# Altium schematic sheet RdriveC1.SchDoc
size A2; SheetNumber: 1
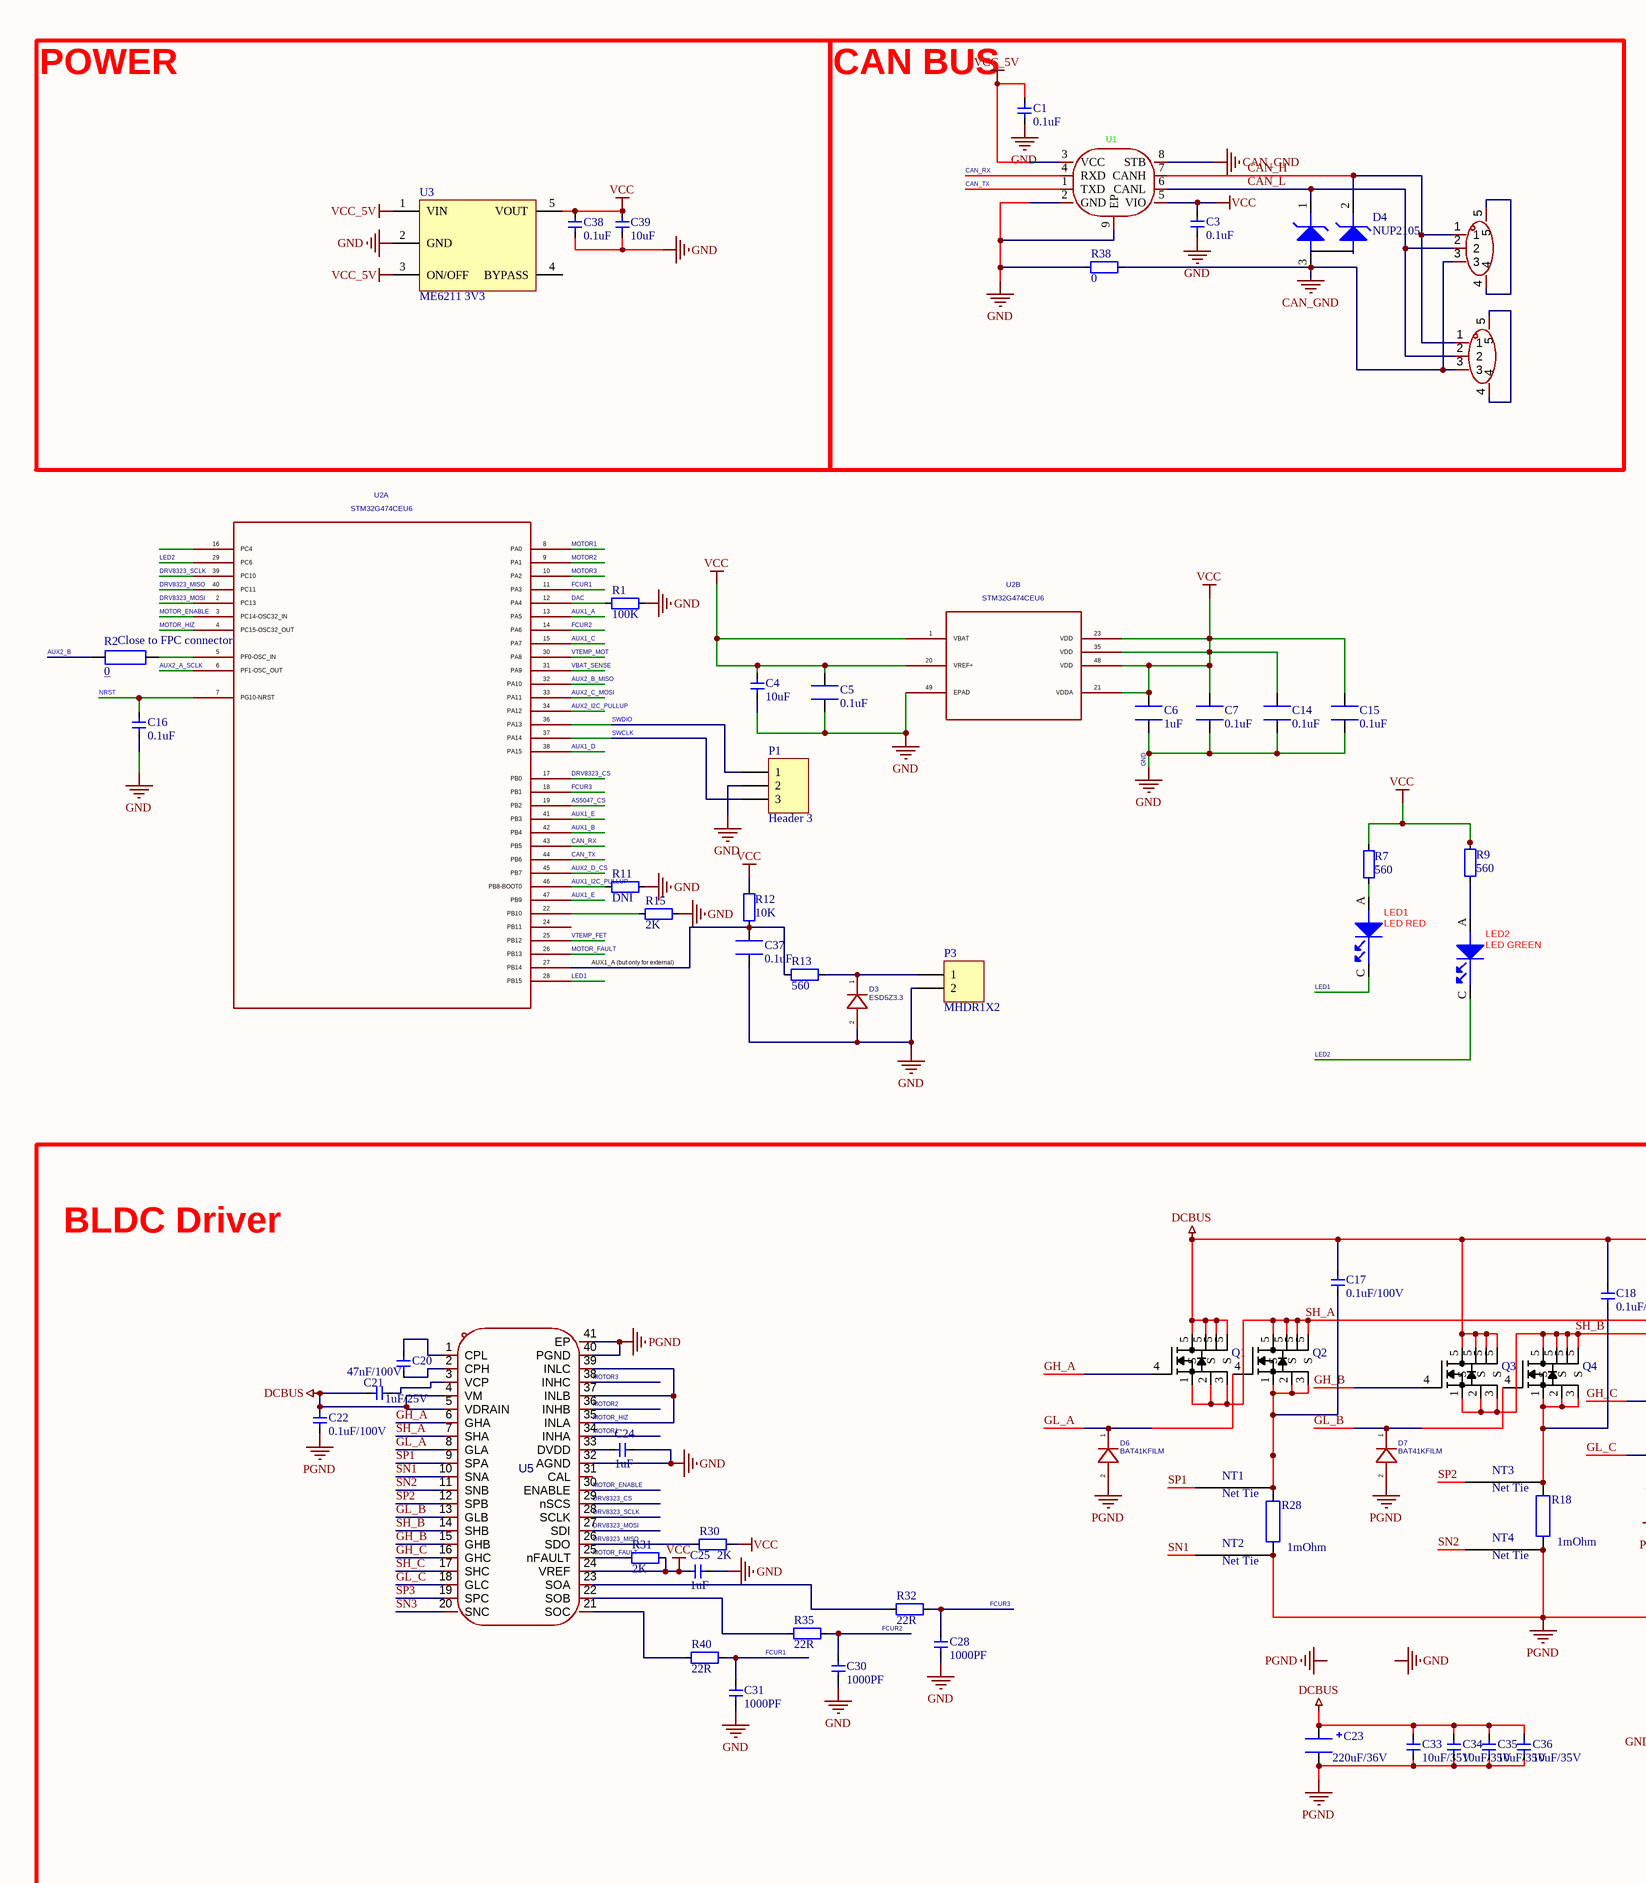
[diagram p0: RdriveC1.SchDoc, left]
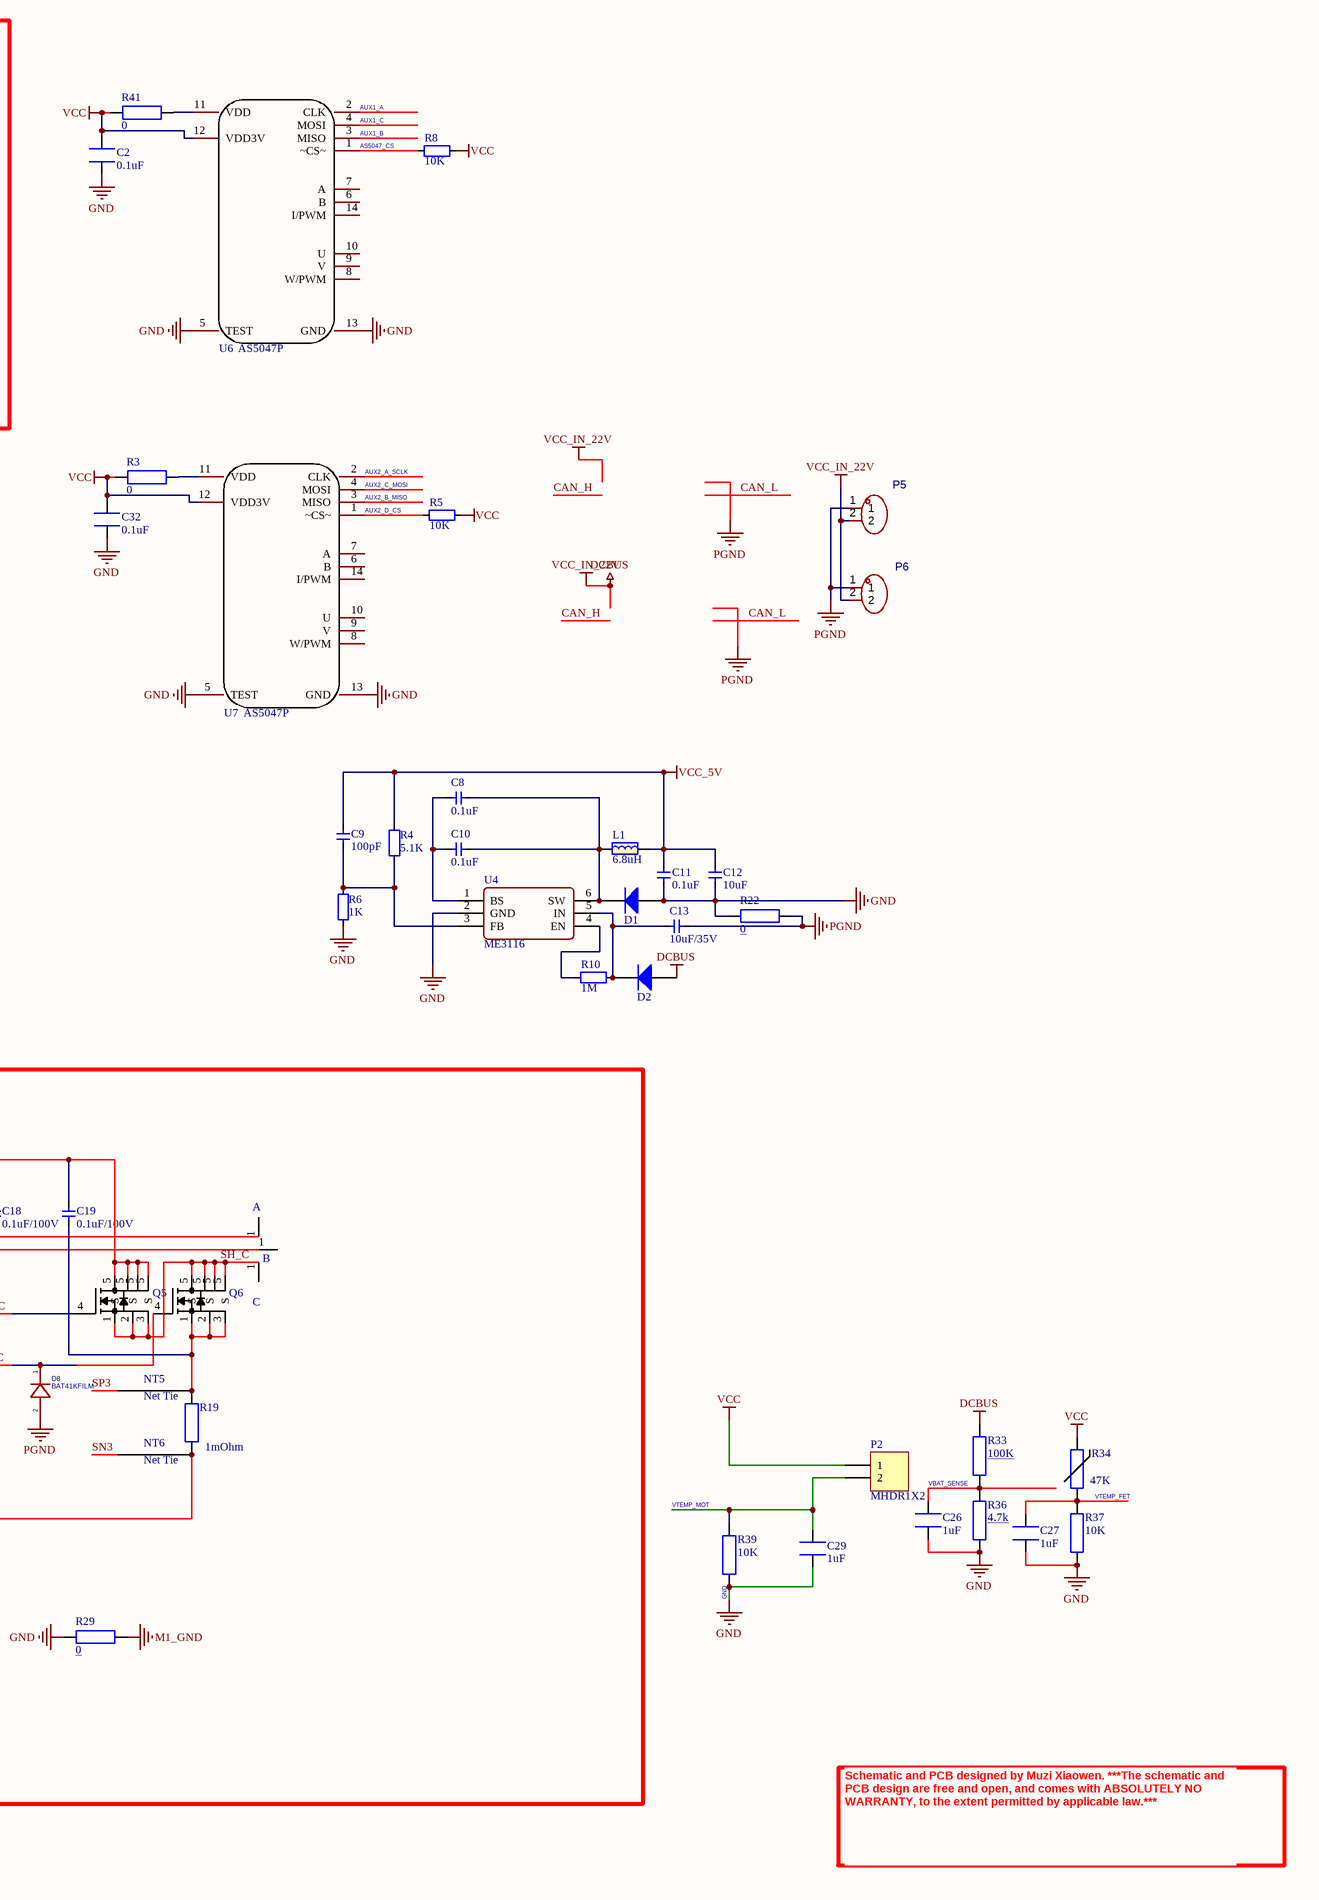
[diagram p1: RdriveC1.SchDoc, right]

## Parts
A  M  [motor]  (value not drawn)
B  M  [motor]  (value not drawn)
C  M  [motor]  (value not drawn)
C1  0.1uF  [CAP_0402]
C2  0.1uF  [CAP_0402]
C3  0.1uF  [CAP_0402]
C4  10uF  [CAP_0402]
C5  0.1uF  [CAP_0402]
C6  1uF  [CAP_0402]
C7  0.1uF  [CAP_0402]
C8  0.1uF  [CAP_0402]
C9  100pF  [CAP_0402]
C10  0.1uF  [CAP_0402]
C11  0.1uF  [CAP_0402]
C12  10uF  [CAP_0402]
C13  10uF/35V  [C0603]
C14  0.1uF  [CAP_0402]
C15  0.1uF  [CAP_0402]
C16  0.1uF  [CAP_0402]
C17  0.1uF/100V  [1206-RES]
C18  0.1uF/100V  [1206-RES]
C19  0.1uF/100V  [1206-RES]
C20  47nF/100V  [C0603]
C21  1uF/25V  [C0603]
C22  0.1uF/100V  [C0603]
C23  value 220uF/36V  [3d-CAP-SMD_BD6.3-L6.6-W6.6-LS7.2-FD]  (hidden comment: 220uF)
C24  1uF  [CAP_0402]
C25  1uF  [CAP_0402]
C26  1uF  [CAP_0402]
C27  1uF  [CAP_0402]
C28  1000PF  [CAP_0402]
C29  1uF  [CAP_0402]
C30  1000PF  [CAP_0402]
C31  1000PF  [CAP_0402]
C32  0.1uF  [CAP_0402]
C33  10uF/35V  [C0603-3d]
C34  10uF/35V  [C0603-3d]
C35  10uF/35V  [C0603-3d]
C36  10uF/35V  [C0603-3d]
C37  0.1uF  [CAP_0402]
C38  0.1uF  [CAP_0402]
C39  10uF  [CAP_0402]
CN1  WAFER-GH1.25-3PLT-W1-P  [CONN-SMD_WAFER-GH1.25-3PLT-W1-P]  (value not drawn)
CN2  WAFER-GH1.25-3PLT-W1-P  [CONN-SMD_WAFER-GH1.25-3PLT-W1-P]  (value not drawn)
D1  二极管-5819W  [SOD-323]  (value not drawn)
D2  二极管-5819W  [SOD-323]  (value not drawn)
D3  value ESD5Z3.3  [moteus:SOD-523_STM]  (hidden comment: moteus_BAT41KFILM)
D4  NUP2105  [SOT23-3]
D6  value BAT41KFILM  [moteus:SOD-523_STM]  (hidden comment: moteus_BAT41KFILM)
D7  value BAT41KFILM  [moteus:SOD-523_STM]  (hidden comment: moteus_BAT41KFILM)
D8  value BAT41KFILM  [moteus:SOD-523_STM]  (hidden comment: moteus_BAT41KFILM)
L1  6.8uH  [IND-201612]
LED1  LED RED  [LC-0603_LED_S3]
LED2  LED GREEN  [LC-0603_LED_S3]
NT1  0.25mm  [NetTie_0.25mm]  (value not drawn)  (net tie, no BOM)
NT2  0.25mm  [NetTie_0.25mm]  (value not drawn)  (net tie, no BOM)
NT3  0.25mm  [NetTie_0.25mm]  (value not drawn)  (net tie, no BOM)
NT4  0.25mm  [NetTie_0.25mm]  (value not drawn)  (net tie, no BOM)
NT5  0.25mm  [NetTie_0.25mm]  (value not drawn)  (net tie, no BOM)
NT6  0.25mm  [NetTie_0.25mm]  (value not drawn)  (net tie, no BOM)
P1  Header 3  [HDR1X3]
P2  MHDR1X2  [MHDR1X2]
P3  MHDR1X2  [CONN-TH_2P-P1.50_HCTL_HC-ZH1.5-2AW]
P5  HC-MX3.0-2*1AW  [CONN-TH_XT30UW-F.G.Y]  (value not drawn)
P6  HC-MX3.0-2*1AW  [CONN-TH_XT30UW-F.G.Y]  (value not drawn)
Q1  SE3082G2  [DFN-8_L5.9-W5.2-P1.27-LS6.2-BL]  (value not drawn)
Q2  SE3082G2  [DFN-8_L5.9-W5.2-P1.27-LS6.2-BL]  (value not drawn)
Q3  SE3082G2  [DFN-8_L5.9-W5.2-P1.27-LS6.2-BL]  (value not drawn)
Q4  SE3082G2  [DFN-8_L5.9-W5.2-P1.27-LS6.2-BL]  (value not drawn)
Q5  SE3082G2  [DFN-8_L5.9-W5.2-P1.27-LS6.2-BL]  (value not drawn)
Q6  SE3082G2  [DFN-8_L5.9-W5.2-P1.27-LS6.2-BL]  (value not drawn)
R1  100K  [RES_0402]
R2  0  [RES_0402]
R3  0  [RES_0402]
R4  5.1K  [RES_0402]
R5  10K  [RES_0402]
R6  1K  [RES_0402]
R7  560  [RES_0402]
R8  10K  [RES_0402]
R9  560  [RES_0402]
R10  1M  [RES_0402]
R11  DNI  [RES_0402]
R12  10K  [RES_0402]
R13  560  [RES_0402]
R15  2K  [RES_0402]
R18  1mOhm  [1206-RES]
R19  1mOhm  [1206-RES]
R22  0  [1206-RES]
R28  1mOhm  [1206-RES]
R29  0  [RES_0402]
R30  2K  [RES_0402]
R31  2K  [RES_0402]
R32  22R  [RES_0402]
R33  100K  [RES_0402]
R34  47K  [CAP_0402]
R35  22R  [RES_0402]
R36  4.7k  [RES_0402]
R37  10K  [RES_0402]
R38  0  [RES_0402]
R39  10K  [RES_0402]
R40  22R  [RES_0402]
R41  0  [RES_0402]
U1  TCAN1057AVDRBRQ1  [SOIC8_2]  (value not drawn)
U2  value STM32G474CEU6  [moteus:UFQFPN-48_7X7X0P55MM]  (hidden comment: moteus_STM32G474CEU6)  (parts A,B of 2)
U3  ME6211 3V3  [SOT23-5-3d]
U4  ME3116  [SOT23-6]
U5  DRV8323SRTAR  [WQFN-40_L6.0-W6.0-P0.50-TL-EP4.5]  (value not drawn)
U6  AS5047P  [TSSOP14_2]
U7  AS5047P  [TSSOP14_2]

## Blocks framed on the sheet
POWER: C38 C39 U3
CAN BUS: C1 C3 CN1 CN2 D4 R38 U1
BLDC Driver: A B C C17-C25 C28 C30 C31 C33-C36 D6-D8 NT1-NT6 Q1-Q6 R18 R19 R28-R32 R35 R40 U5

## Nets
CAN_GND: CN1.3 CN2.3 D4.3(A) R38.2 U1.8(STB)
DCBUS: C17.1 C18.1 C19.1 C21.2 C22.1 C23.1 C33.2 C34.2 C35.2 C36.2 D2.1(A) P5.2 P6.2 Q1.5(D) Q3.5(D) Q5.5(D) R33.2 U5.4(VM) U5.5(VDRAIN)  [also labelled VCC_IN_22V]
GND: C1.2 C2.2 C3.2 C4.1 C5.2 C6.2 C7.1 C11.1 C12.1 C14.2 C15.2 C16.1 C24.1 C25.1 C26.2 C27.2 C28.1 C29.2 C30.1 C31.1 C32.2 C37.2 C38.1 C39.1 D1.1(A) D3.2 P1.2 P3.2 R1.2 R6.2 R11.2 R15.2 R22.2 R29.1 R36.1 R37.2 R38.1 R39.2 U1.2(GND) U1.9(EP) U2.49(EPAD) U3.2(GND) U4.2(GND) U5.32(AGND) U6.5(TEST) U6.13(GND) U7.5(TEST) U7.13(GND)
M1_GND: R29.2
PGND: C13.2 C22.2 C23.2 C33.1 C34.1 C35.1 C36.1 D6.2 D7.2 D8.2 NT2.2 NT4.2 NT6.2 P5.1 P6.1 R18.1 R19.1 R22.1 R28.1 U5.40(PGND) U5.41(EP)
VCC: C2.1 C3.1 C4.2 C5.1 C6.1 C7.2 C14.1 C15.1 C25.2 C32.1 C38.2 C39.2 P2.1 R3.1 R5.1 R7.1 R8.1 R9.1 R12.1 R30.2 R31.2 R34.2 R41.1 U1.5(VIO) U2.1(VBAT) U2.20(VREF+) U2.21(VDDA) U2.23(VDD) U2.35(VDD) U2.48(VDD) U3.5(VOUT) U5.24(VREF) U6.12(VDD3V) U7.12(VDD3V)
VCC_5V: C1.1 C9.1 C11.2 C12.2 L1.2 R4.1 U1.3(VCC) U3.1(VIN) U3.3(ON/OFF)
AS5047_CS: R8.2 U2.19(PB2) U6.1(~CS~)
AUX1_A: U2.13(PA5) U6.2(CLK)
AUX1_B: U2.42(PB4) U6.3(MISO)
AUX1_C: U2.15(PA7) U6.4(MOSI)
AUX1_D: U2.38(PA15)
AUX1_E: U2.41(PB3) U2.47(PB9)
AUX1_I2C_PULLUP: R11.1 U2.46(PB8-BOOT0)
AUX2_A_SCLK: U2.6(PF1-OSC_OUT) U7.2(CLK)
AUX2_B: R2.1
AUX2_B_MISO: U2.32(PA10) U7.3(MISO)
AUX2_C_MOSI: U2.33(PA11) U7.4(MOSI)
AUX2_D_CS: R5.2 U2.45(PB7) U7.1(~CS~)
AUX2_I2C_PULLUP: U2.34(PA12)
CAN_H: CN1.1 CN2.1 D4.2(C) U1.7(CANH)
CAN_L: CN1.2 CN2.2 D4.1(C) U1.6(CANL)
CAN_RX: U1.4(RXD) U2.43(PB5)
CAN_TX: U1.1(TXD) U2.44(PB6)
DAC: R1.1 U2.12(PA4)
DRV8323_CS: U2.17(PB0) U5.29(nSCS)
DRV8323_MISO: R30.1 U2.40(PC11) U5.26(SDO)
DRV8323_MOSI: U2.2(PC13) U5.27(SDI)
DRV8323_SCLK: U2.39(PC10) U5.28(SCLK)
FCUR1: C31.2 R40.1 U2.11(PA3)
FCUR2: C30.2 R35.1 U2.14(PA6)
FCUR3: C28.2 R32.1 U2.18(PB1)
GH_A: Q1.4(G1) U5.6(GHA)
GH_B: Q3.4(G1) U5.15(GHB)
GH_C: Q5.4(G1) U5.16(GHC)
GL_A: D6.1 Q2.4(G1) U5.8(GLA)
GL_B: D7.1 Q4.4(G1) U5.13(GLB)
GL_C: D8.1 Q6.4(G1) U5.18(GLC)
LED1: LED1.C(CATHODE) U2.28(PB15)
LED2: LED2.C(CATHODE) U2.29(PC6)
MOTOR1: U2.8(PA0) U5.34(INHA)
MOTOR2: U2.9(PA1) U5.36(INHB)
MOTOR3: U2.10(PA2) U5.38(INHC)
MOTOR_ENABLE: U2.3(PC14-OSC32_IN) U5.30(ENABLE)
MOTOR_FAULT: R31.1 U2.26(PB13) U5.25(nFAULT)
MOTOR_HIZ: U2.4(PC15-OSC32_OUT) U5.35(INLA) U5.37(INLB) U5.39(INLC)
NRST: C16.2 U2.7(PG10-NRST)
SH_A: A.1 Q1.1(S) Q1.2(S) Q1.3(S) Q2.5(D) U5.7(SHA)
SH_B: B.1 Q3.1(S) Q3.2(S) Q3.3(S) Q4.5(D) U5.14(SHB)
SH_C: C.1 Q5.1(S) Q5.2(S) Q5.3(S) Q6.5(D) U5.17(SHC)
SN1: NT2.1 U5.10(SNA)
SN2: NT4.1 U5.11(SNB)
SN3: NT6.1 U5.20(SNC)
SP1: NT1.1 U5.9(SPA)
SP2: NT3.1 U5.12(SPB)
SP3: NT5.1 U5.19(SPC)
SWCLK: P1.3 U2.37(PA14)
SWDIO: P1.1 U2.36(PA13)
VBAT_SENSE: C26.1 R33.1 R36.2 U2.31(PA9)
VTEMP_FET: C27.1 R34.1 R37.1 U2.25(PB12)
VTEMP_MOT: C29.1 P2.2 R39.1 U2.30(PA8)
NetC8_1: C8.1 C10.1 D1.2(K) L1.1 U4.6(SW)
NetC8_2: C8.2 C10.2 U4.1(BS)
NetC9_2: C9.2 R4.2 R6.1 U4.3(FB)
NetC13_1: C13.1 D2.2(K) R10.2 U4.5(IN)
NetC17_2: C17.2 NT1.2 Q2.1(S) Q2.2(S) Q2.3(S) R28.2
NetC18_2: C18.2 NT3.2 Q4.1(S) Q4.2(S) Q4.3(S) R18.2
NetC19_2: C19.2 NT5.2 Q6.1(S) Q6.2(S) Q6.3(S) R19.2
NetC20_1: C20.1 U5.2(CPH)
NetC20_2: C20.2 U5.1(CPL)
NetC21_1: C21.1 U5.3(VCP)
NetC24_2: C24.2 U5.33(DVDD)
NetC37_1: C37.1 R12.2 R13.1 U2.27(PB14)
NetCN1_4: CN1.4 CN1.5
NetCN2_4: CN2.4 CN2.5
NetD3_1: D3.1 P3.1 R13.2
NetLED1_A: LED1.A(ANODE) R7.2
NetLED2_A: LED2.A(ANODE) R9.2
NetR2_2: R2.2 U2.5(PF0-OSC_IN)
NetR3_2: R3.2 U7.11(VDD)
NetR10_1: R10.1 U4.4(EN)
NetR15_1: R15.1 U2.22(PB10)
NetR32_2: R32.2 U5.23(SOA)
NetR35_2: R35.2 U5.22(SOB)
NetR40_2: R40.2 U5.21(SOC)
NetR41_2: R41.2 U6.11(VDD)

Not connected (* = marked no-connect by the designer): U2 16(PC4) 24(PB11); U3 4(BYPASS); U5 31(CAL); U6 6(B) 7(A) 8(W/PWM) 9(V) 10(U) 14(I/PWM); U7 6(B) 7(A) 8(W/PWM) 9(V) 10(U) 14(I/PWM)

## Notes on the sheet
- (near U2) Close to FPC connector
- AUX1_A (but only for external)
- Schematic and PCB designed by Muzi Xiaowen. ***The schematic and PCB design are free and open, and comes with ABSOLUTELY NO WARRANTY, to the extent permitted by applicable law.***
- Labels drawn without touching a wire or pin: GND, PGND
- (in symbol NetTie_0.25mm) Net Tie

## Library data of the parts
C1 C3 C4 C8 C10-C12 C16 C38 C39 = 电容-0402: Capacitor; Value: 0.1u
C2 C5 C7 C14 C15 C32 C37 = GRM188R71H104KA93D: CAP CER 0.1UF 50V X7R 0603; Manufacturer: Murata Electronics North America; Tolerance: ±10%; Supplier 1: Digi-Key; Supplier Part Number 1: 490-1519-2-ND; Manufacturer Part Number: GRM188R71H104KA93D; RoHS: RoHS Compliant; Category: Capacitors; Pricing 1: 4000=0.01822, 8000=0.01663, 12000=0.01584 (USD); Packaging: Tape & Reel (TR); Capacitance: 0.1uF; Voltage - Rated: 50V; Temperature Coefficient: X7R; Mounting Type: Surface Mount, MLCC; Operating Temperature: -55°C ~ 125°C; Applications: General Purpose; Ratings: -; Package / Case: 0603 (1608 Metric); Size / Dimension: 0.063" L x 0.032" W (1.60mm x 0.80mm); Height - Seated (Max): -; Thickness (Max): 0.035" (0.90mm); Lead Spacing: -; Features: -; Lead Style: -; ComponentLink1URL: http://www.murata.com/~/media/webrenewal/support/library/catalog/products/capacitor/mlcc/c02e.ashx?la=en-us; ComponentLink1Description: http://www.murata.com/~/media/webrenewal/support/library/catalog/products/capacitor/mlcc/c02e.ashx?la=en-us; Stock: 19812000; Part Status: Active; Supplier 2: Digi-Key; Supplier Part Number 2: 490-1519-1-ND; Pricing 2: 1=0.12, 10=0.084, 100=0.0396, 500=0.02778, 1000=0.023 (USD)
C6 C26 C27 C29 = GRM188R71H104KA93D: CAP CER 1UF 50V X7R 0603; Manufacturer: Murata Electronics North America; Tolerance: ±10%; Supplier 1: Digi-Key; Supplier Part Number 1: 490-1519-2-ND; Manufacturer Part Number: GRM188R71H104KA93D; RoHS: RoHS Compliant; Category: Capacitors; Pricing 1: 4000=0.01822, 8000=0.01663, 12000=0.01584 (USD); Packaging: Tape & Reel (TR); Capacitance: 1uF; Voltage - Rated: 50V; Temperature Coefficient: X7R; Mounting Type: Surface Mount, MLCC; Operating Temperature: -55°C ~ 125°C; Applications: General Purpose; Ratings: -; Package / Case: 0603 (1608 Metric); Size / Dimension: 0.063" L x 0.032" W (1.60mm x 0.80mm); Height - Seated (Max): -; Thickness (Max): 0.035" (0.90mm); Lead Spacing: -; Features: -; Lead Style: -; ComponentLink1URL: http://www.murata.com/~/media/webrenewal/support/library/catalog/products/capacitor/mlcc/c02e.ashx?la=en-us; ComponentLink1Description: http://www.murata.com/~/media/webrenewal/support/library/catalog/products/capacitor/mlcc/c02e.ashx?la=en-us; Stock: 19812000; Part Status: Active; Supplier 2: Digi-Key; Supplier Part Number 2: 490-1519-1-ND; Pricing 2: 1=0.12, 10=0.084, 100=0.0396, 500=0.02778, 1000=0.023 (USD)
C9 C17-C22 C24 C25 C28 C30 C31 = 电容-0402: Capacitor
  C9: Value: 100pF
  C17-C19 C22: Value: 0.1uF/100V
  C20: Value: 47nF/100V
  C21: Value: 1uF/25V
  C24 C25: Value: 1uF
  C28 C30 C31: Value: 1000PF
C13 C33-C36 = 电容-0402: Capacitor; Value: 22uF 35V
C23 = EEEFP1E471AP: CAP, FP Series, 470 µF, 25 V, Radial Can - SMD, 10 mm; Manufacturer: Panasonic Electronic Components; Manufacturer Part Number: EEE-FP1E471AP; Tolerance: ±20%; ESR (Equivalent Series Resistance): 60 mOhm @ 100kHz; Lifetime @ Temp.: 2000 Hrs @ 105°C; Polarization: Polar; Ripple Current - Low Frequency: 773.5mA @ 120Hz; Ripple Current - High Frequency: 1.19A @ 100kHz; Surface Mount Land Size: 0.406" L x 0.406" W (10.30mm x 10.30mm); Supplier 1: Digi-Key; Supplier Part Number 1: PCE4440TR-ND; RoHS: RoHS Compliant; Category: Capacitors; Stock: 8000; Pricing 1: 500=0.3571, 1000=0.30072, 2500=0.28192, 5000=0.26313, 12500=0.24997, 25000=0.24434 (USD); Packaging: Tape & Reel (TR); Part Status: Active; Operating Temperature: -55°C ~ 105°C; Applications: Automotive; Lead Spacing: -; Size / Dimension: 0.394" Dia (10.00mm); Height - Seated (Max): 0.402" (10.20mm); Mounting Type: Surface Mount; Package / Case: Radial, Can - SMD; ComponentLink1URL: http://industrial.panasonic.com/www-cgi/jvcr13pz.cgi?E+PZ+3+ABA0114+EEEFP1E471AP+7+WW; ComponentLink1Description: http://industrial.panasonic.com/www-cgi/jvcr13pz.cgi?E+PZ+3+ABA0114+EEEFP1E471AP+7+WW; Supplier 2: Digi-Key; Supplier Part Number 2: PCE4440CT-ND; Pricing 2: 1=0.92, 10=0.702, 100=0.5025 (USD)
D1 D2 = 二极管-5819W: 40V
D3 D6-D8 = moteus_BAT41KFILM: MF: ST; POPULATE: 1; ki_fp_filters: SOD-523_STM SOD-523_STM-M SOD-523_STM-L; UniqueId: e417e3fc4267d002; AddInBom: yes; Device: moteus_BAT41KFILM; Symbol: moteus_BAT41KFILM; UserDocLink: BAT41KFILM; MPN: BAT41KFILM; ki_keywords: BAT41KFILM; FootprintName: moteus:SOD-523_STM
L1 = 电感-201612
LED1 LED2 = LED: LED GRN SGL RA 25mA 4.1V SMD; CLASS: IC; CAD_APPROVED: Yes; MFG_PN01: AA4040ZGS; MFG_NAME01: Kingbright; AGILE_PN: 370-76642; PN: 19-217/G7C-AN1P2/3T; HEIGHT: 4.25MM; ROHS: Yes
NT1-NT6 = NetTie_0.25mm
P1 = Header 3: Header, 3-Pin; LatestRevisionDate: 17-Jul-2002; LatestRevisionNote: Re-released for DXP Platform.; Publisher: Altium Limited
P2 P3 = MHDR1X2: Header, 2-Pin; LatestRevisionDate: 17-Jul-2002; LatestRevisionNote: Re-released for DXP Platform.; Publisher: Altium Limited
Q1-Q6 = SE3082G2: MOSFET N-CH 30V 13A SO8FL; Manufacturer: ON Semiconductor; Manufacturer Part Number: NTMFS4935NT1G; FET Type: N-Channel; Current - Continuous Drain (Id) @ 25°C: 13A (Ta), 93A (Tc); Drive Voltage (Max Rds On,  Min Rds On): 4.5V, 10V; Vgs(th) (Max) @ Id: 2.2V @ 250µA; Gate Charge (Qg) (Max) @ Vgs: 49.4nC @ 10V; Input Capacitance (Ciss) (Max) @ Vds: 4850pF @ 15V; Vgs (Max): ±20V; Power Dissipation (Max): 930mW (Ta), 48W (Tc); Rds On (Max) @ Id, Vgs: 3.2 mOhm @ 30A, 10V; Supplier 1: Digi-Key; Supplier Part Number 1: NTMFS4935NT1GOSCT-ND; RoHS: RoHS Compliant; Category: Discrete Semiconductor Products; Stock 1: 932; Pricing 1: 1=0.61, 10=0.541, 100=0.4145, 500=0.3277 (USD); Packaging: Cut Tape (CT); Part Status: Active; Technology: MOSFET (Metal Oxide); Drain to Source Voltage (Vdss): 30V; FET Feature: -; Operating Temperature: -55°C ~ 150°C (TJ); Mounting Type: Surface Mount; Supplier Device Package: 5-DFN (5x6) (8-SOFL); Package / Case: 8-PowerTDFN, 5 Leads; ComponentLink1URL: http://www.onsemi.com/pub_link/Collateral/NTMFS4935N-D.PDF; ComponentLink1Description: http://www.onsemi.com/pub_link/Collateral/NTMFS4935N-D.PDF
R1 R4 R6 R10 R11 R15 R30 R31 R38 = 电阻-0402: Resistor
  R1: Value: 100K
  R4: Value: 5.1K
  R6: Value: 1K
  R10: Value: 1M
  R11: Value: DNI
  R15 R30 R31: Value: 2K
  R38: Value: 0
R2 R3 R22 R29 R33 R36 R41 = RC0603FR-071KL: RES SMD 1K OHM 1% 1/10W 0603; Manufacturer: Yageo; Power (Watts): 0.1W, 1/10W; Temperature Coefficient: ±100ppm/°C; Supplier 1: Digi-Key; Supplier Part Number 1: 311-1.00KHRCT-ND; RoHS: RoHS Compliant; Category: Resistors; Stock 1: 6734836; Pricing 1: 1=0.1, 10=0.014, 25=0.01, 100=0.0057, 250=0.00436, 500=0.00348, 1000=0.00257, 2500=0.00223 (USD); Packaging: Cut Tape (CT); Tolerance: ±1%; Composition: Thick Film; Features: Moisture Resistant; Operating Temperature: -55°C ~ 155°C; Package / Case: 0603 (1608 Metric); Supplier Device Package: 0603; Size / Dimension: 0.063" L x 0.031" W (1.60mm x 0.80mm); Height: 0.022" (0.55mm); Number of Terminations: 2; ComponentLink1URL: http://www.yageo.com/documents/recent/PYu-RC_Group_51_RoHS_L_04.pdf; ComponentLink1Description: http://www.yageo.com/documents/recent/PYu-RC_Group_51_RoHS_L_04.pdf; Manufacturer Part Number: RC0603FR-071KL; Resistance (Ohms): 1k
R5 R7-R9 R12 R13 = 电阻-0402: Resistor; Value: 22R
R18 R19 R28 = CSR2512C0R0005F: RES SMD 0.0005 OHM 1% 3W 2512; Manufacturer: Riedon; Temperature Coefficient: ±100ppm/°C; Value: 1mOhm; Supplier 1: Digi-Key; Supplier Part Number 1: 696-1183-2-ND; RoHS: RoHS Compliant; Category: Resistors; Stock: 2000; Pricing 1: 2000=0.19817, 6000=0.1937, 10000=0.187, 50000=0.18148 (USD); Packaging: Tape & Reel (TR); Part Status: Active; Tolerance: ±1%; Power (Watts): 3W; Composition: Metal Element; Features: Current Sense; Operating Temperature: -55°C ~ 170°C; Package / Case: 2512 (6432 Metric); Supplier Device Package: 2512; Size / Dimension: 0.250" L x 0.118" W (6.35mm x 3.00mm); Height - Seated (Max): 0.057" (1.45mm); Failure Rate: -; ComponentLink1URL: http://riedon.com/media/pdf/CSR.pdf; ComponentLink1Description: http://riedon.com/media/pdf/CSR.pdf; Supplier 2: Digi-Key; Supplier Part Number 2: 696-1183-1-ND; Pricing 2: 1=0.69, 10=0.574, 25=0.4916, 50=0.4426, 100=0.3852, 250=0.3442, 500=0.27864, 1000=0.22536 (USD); Manufacturer Part Number: CSR2512C0R0005F
R32 R35 R40 = 电阻-0402: Resistor; Value: 2.2R
R34 = NCP15XH103F03RC: THERMISTOR 10K OHM NTC 0402 SMD; Value: 47K
R37 R39 = RC0603FR-073K3L: RES SMD 3.3K OHM 1% 1/10W 0603; Manufacturer: Yageo; Power (Watts): 0.1W, 1/10W; Temperature Coefficient: ±100ppm/°C; Supplier 1: Digi-Key; Supplier Part Number 1: 311-3.30KHRCT-ND; Manufacturer Part Number: RC0603FR-073K3L; RoHS: RoHS Compliant; Category: Resistors; Stock 1: 420019; Pricing 1: 1=0.1, 10=0.014, 25=0.01, 100=0.0057, 250=0.00436, 500=0.00348, 1000=0.00257, 2500=0.00223 (USD); Packaging: Cut Tape (CT); Resistance (Ohms): 3.3k; Tolerance: ±1%; Composition: Thick Film; Features: Moisture Resistant; Operating Temperature: -55°C ~ 155°C; Package / Case: 0603 (1608 Metric); Supplier Device Package: 0603; Size / Dimension: 0.063" L x 0.031" W (1.60mm x 0.80mm); Height: 0.022" (0.55mm); Number of Terminations: 2; ComponentLink1URL: http://www.yageo.com/documents/recent/PYu-RC_Group_51_RoHS_L_04.pdf; ComponentLink1Description: http://www.yageo.com/documents/recent/PYu-RC_Group_51_RoHS_L_04.pdf
U1 = SIT1042ATK/3: Manufacturer: SIT(芯力特); Add into BOM: yes; Data Rate: 5Mbps; Supply Voltage: 4.5V~5.5V; Symbol: SIT1042ATK/3; Device: SIT1042ATK/3; LCSC Part Name: SIT1042A CAN FD待机模式总线收发器; Supplier Part: C5382546; Manufacturer Part: SIT1042ATK/3; Supplier Footprint: DFN-8(3x3); JLCPCB Part Class: Extended Part; Datasheet: https://atta.szlcsc.com/upload/public/pdf/source/20240906/0721301B0EA65A9C8E3ABE7B44C999B5.pdf; Supplier: LCSC; Convert to PCB: yes; Type: CAN-FD收发器; Supply Current: -; Operating Temperature: -40℃~+150℃
U2 = moteus_STM32G474CEU6: MF: ST; POPULATE: 1; ki_fp_filters: UFQFPN-48_7X7X0P55MM UFQFPN-48_7X7X0P55MM-M UFQFPN-48_7X7X0P55MM-L; UniqueId: eac3f191c372887e; AddInBom: yes; Device: moteus_STM32G474CEU6; Symbol: moteus_STM32G474CEU6; UserDocLink: STM32G474CEU6; MPN: STM32G474CEU6; ki_keywords: STM32G474CEU6; FootprintName: moteus:UFQFPN-48_7X7X0P55MM
U3 = LP2992: LDO
U4 = ME3116: DC-DC
U6 U7 = AS5047P: Add into BOM: yes; Origin Footprint: TSSOP-14; Name: AS5047P; Symbol: AS5047P; Device: AS5047P; Convert to PCB: yes
CN1 CN2 = WAFER-GH1.25-3PLT-W1-P: Symbol: WAFER-GH1.25-3PLT-W1-P
P5 P6 = HC-MX3.0-2*1AW: Symbol: HC-MX3.0-2*1AW
U5 = DRV8323SRTAR: Symbol: DRV8323SRTAR